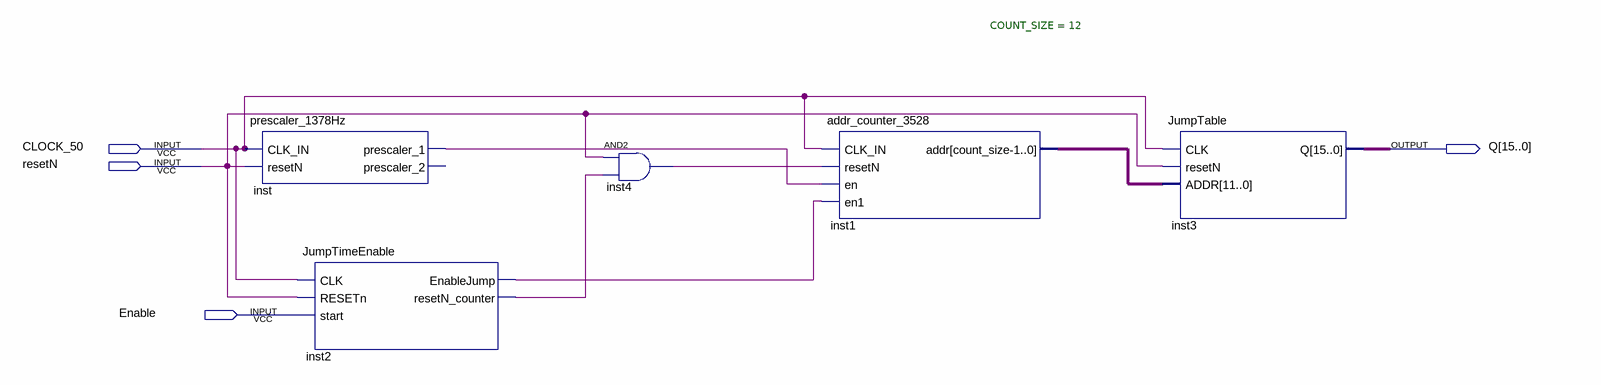
[diagram p0: schematic sheet]
// Quartus schematic JumpSound.bdf as structural Verilog: 5 symbols, 4 pins
module JumpSound (
  input  CLOCK_50,
  input  resetN,
  input  Enable,
  output [15:0] Q
);

  wire inst2_enablejump, inst2_resetn_counter, inst4_out, inst_prescaler_1;
  wire [11:0] inst1_addr;

  prescaler_1378Hz inst (.CLK_IN(CLOCK_50), .resetN(resetN), .prescaler_1(inst_prescaler_1));  // open: prescaler_2
  JumpTimeEnable inst2 (
    .CLK(CLOCK_50), .RESETn(resetN), .start(Enable), .EnableJump(inst2_enablejump),
    .resetN_counter(inst2_resetn_counter));
  and inst4 (inst4_out, resetN, inst2_resetn_counter);
  addr_counter_3528 #(.COUNT_SIZE(12)) inst1 (
    .CLK_IN(CLOCK_50), .resetN(inst4_out), .en(inst_prescaler_1), .en1(inst2_enablejump), .addr(inst1_addr));
  JumpTable inst3 (.CLK(CLOCK_50), .resetN(resetN), .ADDR(inst1_addr), .Q(Q));
endmodule
